# EAGLE design Wave Fold Osc MAIN V2.1 (EAGLE 7.7.0)
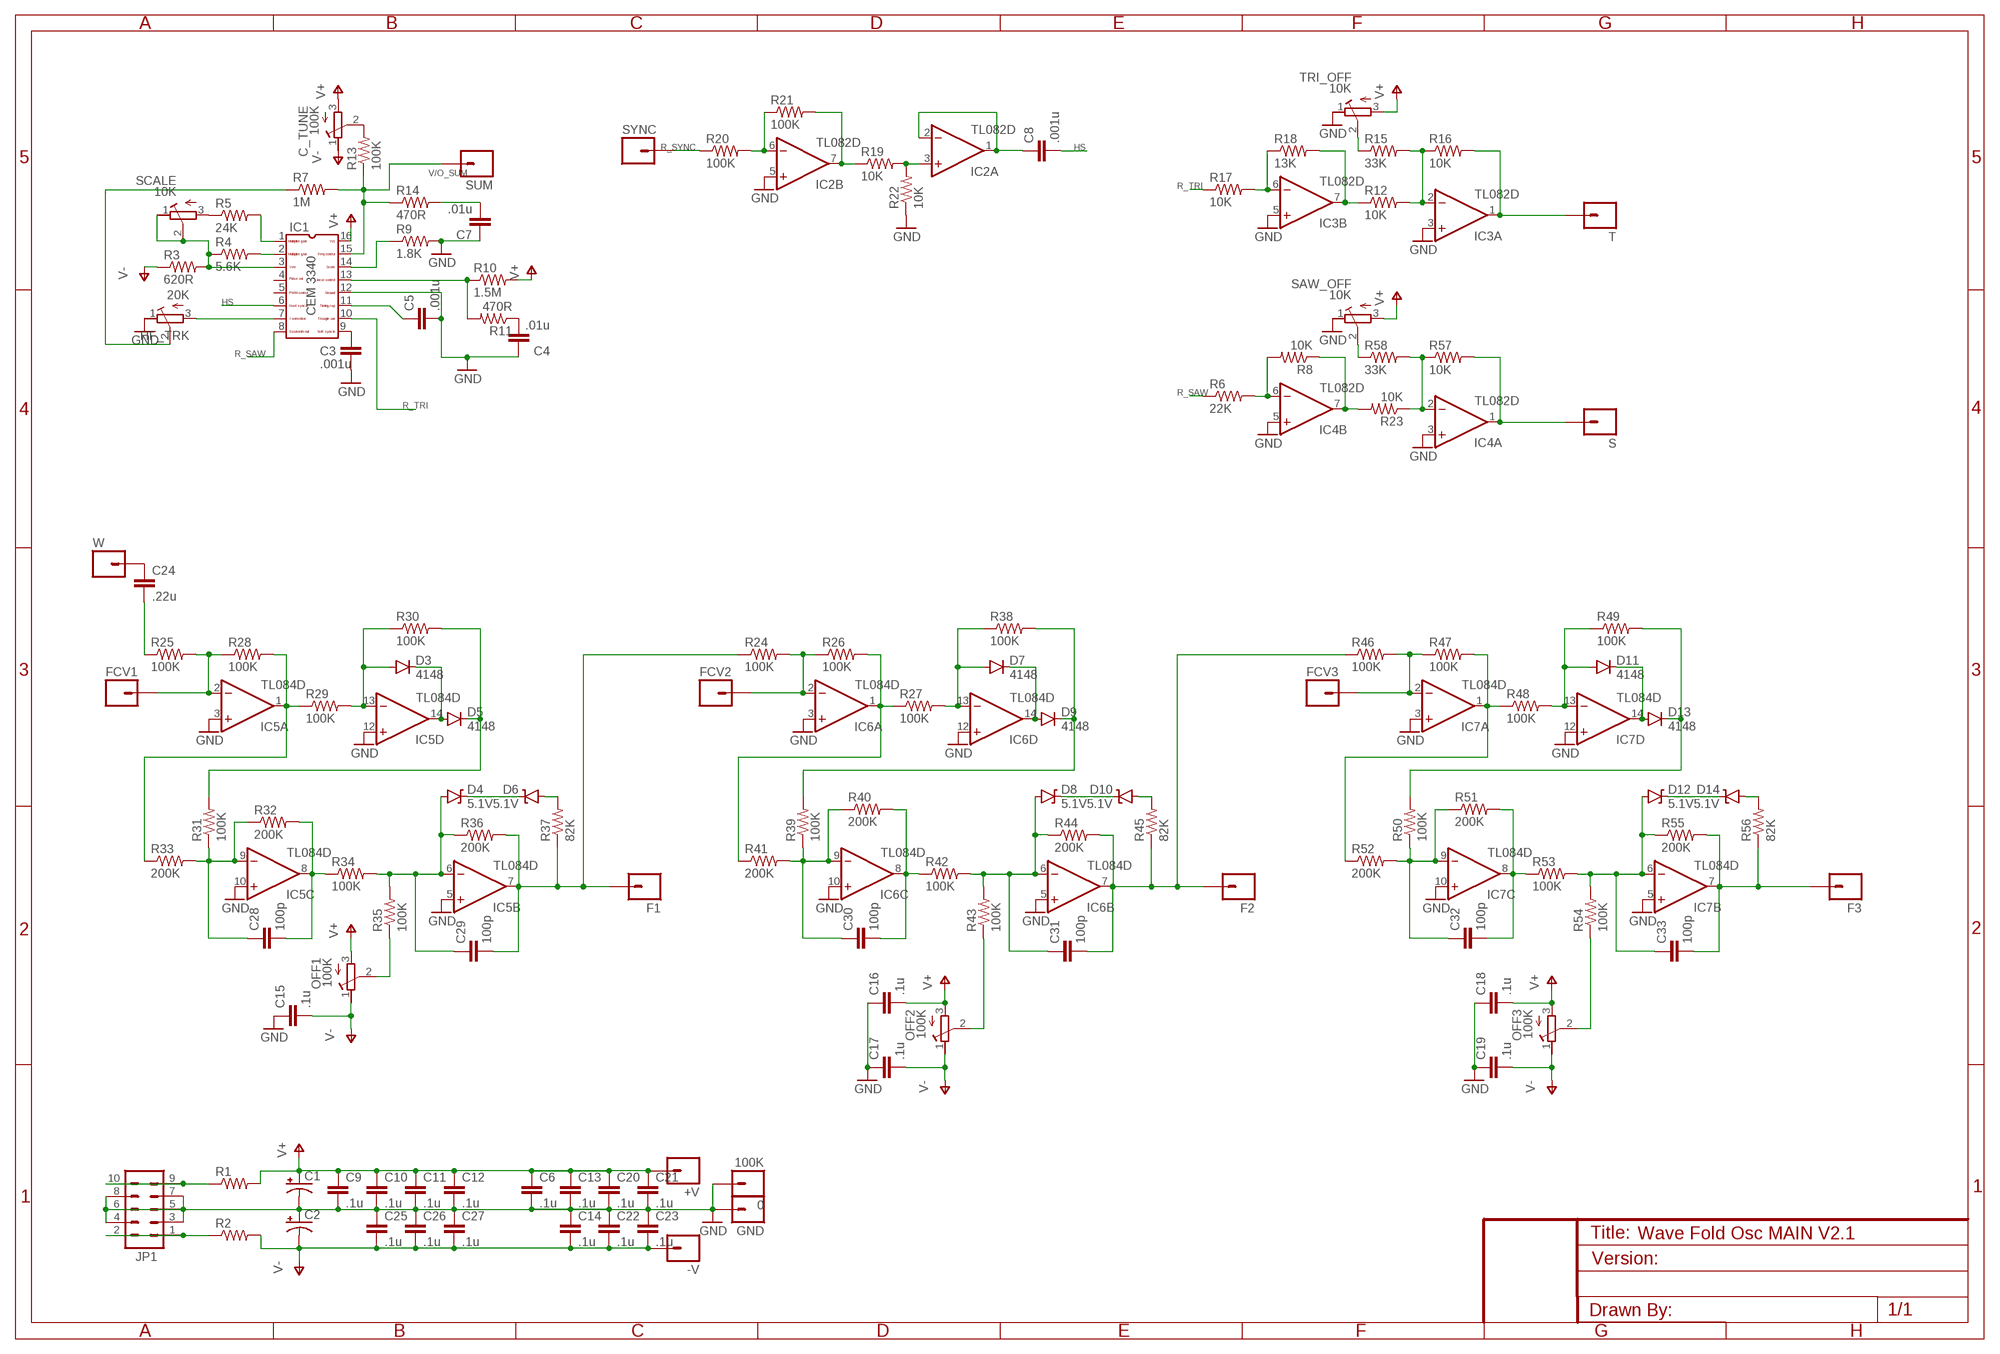
[diagram p0: schematic, sheet 1]

## Parts
0  100K  M01PTH  [1X01]
+V  M01PTH  [1X01]
-V  M01PTH  [1X01]
C1  CAP_POLC  [PANASONIC_C]
C2  CAP_POLC  [PANASONIC_C]
C3  .001u  CAP0805  [0805]
C4  .01u  CAP0805  [0805]
C5  .001u  C5/2.5  [C5B2.5]
C6  .1u  CAP0805  [0805@1]
C7  .01u  CAP0805  [0805]
C8  .001u  CAP0805  [0805]
C9  .1u  CAP0805  [0805@1]
C10  .1u  CAP0805  [0805@1]
C11  .1u  CAP0805  [0805@1]
C12  .1u  CAP0805  [0805@1]
C13  .1u  CAP0805  [0805@1]
C14  .1u  CAP0805  [0805@1]
C15  .1u  CAP0805  [0805]
C16  .1u  CAP0805  [0805]
C17  .1u  CAP0805  [0805]
C18  .1u  CAP0805  [0805]
C19  .1u  CAP0805  [0805]
C20  .1u  CAP0805  [0805@1]
C21  .1u  CAP0805  [0805@1]
C22  .1u  CAP0805  [0805@1]
C23  .1u  CAP0805  [0805@1]
C24  .22u  CAP0805  [0805@1]
C25  .1u  CAP0805  [0805@1]
C26  .1u  CAP0805  [0805@1]
C27  .1u  CAP0805  [0805@1]
C28  100p  CAP0805  [0805@1]
C29  100p  CAP0805  [0805@1]
C30  100p  CAP0805  [0805@1]
C31  100p  CAP0805  [0805@1]
C32  100p  CAP0805  [0805@1]
C33  100p  CAP0805  [0805@1]
C_TUNE  100K  R-TRIMM3314G  [RTRIM3314G]
D3  4148  DIODESOD123  [SOD-123]
D4  5.1V  DIODE-ZENER16V  [SOD-123]
D5  4148  DIODESOD123  [SOD-123]
D6  5.1V  DIODE-ZENER16V  [SOD-123]
D7  4148  DIODESOD123  [SOD-123]
D8  5.1V  DIODE-ZENER16V  [SOD-123]
D9  4148  DIODESOD123  [SOD-123]
D10  5.1V  DIODE-ZENER16V  [SOD-123]
D11  4148  DIODESOD123  [SOD-123]
D12  5.1V  DIODE-ZENER16V  [SOD-123]
D13  4148  DIODESOD123  [SOD-123]
D14  5.1V  DIODE-ZENER16V  [SOD-123]
F1  M01PTH  [1X01]
F2  M01PTH  [1X01]
F3  M01PTH  [1X01]
FCV1  M01PTH  [1X01]
FCV2  M01PTH  [1X01]
FCV3  M01PTH  [1X01]
GND  M01PTH  [1X01]
HF_TRK  20K  R-TRIMM3314G  [RTRIM3314G]
IC1  CEM3340_SMD  [SO16]
IC2  TL082D  [SO08]
IC3  TL082D  [SO08]
IC4  TL082D  [SO08]
IC5  TL084D  [SO14]
IC6  TL084D  [SO14]
IC7  TL084D  [SO14]
JP1  M05X2PTH  [AVR_ICSP]
OFF1  100K  R-TRIMM3314G  [RTRIM3314G]
OFF2  100K  R-TRIMM3314G  [RTRIM3314G]
OFF3  100K  R-TRIMM3314G  [RTRIM3314G]
R1  RESISTOR0805-RES  [0805]
R2  RESISTOR0805-RES  [0805]
R3  620R  RESISTOR0805-RES  [0805]
R4  5.6K  RESISTOR0805-RES  [0805]
R5  24K  RESISTOR0805-RES  [0805]
R6  22K  RESISTOR0805-RES  [0805]
R7  1M  RESISTOR0805-RES  [0805]
R8  10K  RESISTOR0805-RES  [0805]
R9  1.8K  RESISTOR0805-RES  [0805]
R10  1.5M  RESISTOR0805-RES  [0805]
R11  470R  RESISTOR0805-RES  [0805]
R12  10K  RESISTOR0805-RES  [0805]
R13  100K  RESISTOR0805-RES  [0805]
R14  470R  RESISTOR0805-RES  [0805]
R15  33K  RESISTOR0805-RES  [0805]
R16  10K  RESISTOR0805-RES  [0805]
R17  10K  RESISTOR0805-RES  [0805]
R18  13K  RESISTOR0805-RES  [0805]
R19  10K  RESISTOR0805-RES  [0805]
R20  100K  RESISTOR0805-RES  [0805]
R21  100K  RESISTOR0805-RES  [0805]
R22  10K  RESISTOR0805-RES  [0805]
R23  10K  RESISTOR0805-RES  [0805]
R24  100K  RESISTOR0805-RES  [0805]
R25  100K  RESISTOR0805-RES  [0805]
R26  100K  RESISTOR0805-RES  [0805]
R27  100K  RESISTOR0805-RES  [0805]
R28  100K  RESISTOR0805-RES  [0805]
R29  100K  RESISTOR0805-RES  [0805]
R30  100K  RESISTOR0805-RES  [0805]
R31  100K  RESISTOR0805-RES  [0805]
R32  200K  RESISTOR0805-RES  [0805]
R33  200K  RESISTOR0805-RES  [0805]
R34  100K  RESISTOR0805-RES  [0805]
R35  100K  RESISTOR0805-RES  [0805]
R36  200K  RESISTOR0805-RES  [0805]
R37  82K  RESISTOR0805-RES  [0805]
R38  100K  RESISTOR0805-RES  [0805]
R39  100K  RESISTOR0805-RES  [0805]
R40  200K  RESISTOR0805-RES  [0805]
R41  200K  RESISTOR0805-RES  [0805]
R42  100K  RESISTOR0805-RES  [0805]
R43  100K  RESISTOR0805-RES  [0805]
R44  200K  RESISTOR0805-RES  [0805]
R45  82K  RESISTOR0805-RES  [0805]
R46  100K  RESISTOR0805-RES  [0805]
R47  100K  RESISTOR0805-RES  [0805]
R48  100K  RESISTOR0805-RES  [0805]
R49  100K  RESISTOR0805-RES  [0805]
R50  100K  RESISTOR0805-RES  [0805]
R51  200K  RESISTOR0805-RES  [0805]
R52  200K  RESISTOR0805-RES  [0805]
R53  100K  RESISTOR0805-RES  [0805]
R54  100K  RESISTOR0805-RES  [0805]
R55  200K  RESISTOR0805-RES  [0805]
R56  82K  RESISTOR0805-RES  [0805]
R57  10K  RESISTOR0805-RES  [0805]
R58  33K  RESISTOR0805-RES  [0805]
S  M01PTH  [1X01]
SAW_OFF  10K  R-TRIMM3314G  [RTRIM3314G]
SCALE  10K  R-TRIMM3314G  [RTRIM3314G]
SUM  M01PTH  [1X01]
SYNC  M01PTH  [1X01]
T  M01PTH  [1X01]
TRI_OFF  10K  R-TRIMM3314G  [RTRIM3314G]
W  M01PTH  [1X01]

## Nets
GND: 0.1 C1.- C2.+ C3.2 C4.1 C5.2 C6.2 C7.1 C9.2 C10.2 C11.2 C12.2 C13.2 C14.1 C15.1 C16.1 C17.1 C18.1 C19.1 C20.2 C21.2 C22.1 C23.1 C25.1 C26.1 C27.1 GND.1 HF_TRK.1(E) IC1.12 IC2.5(B:+IN) IC3.3(A:+IN) IC3.5(B:+IN) IC4.3(A:+IN) IC4.5(B:+IN) IC5.3(A:+IN) IC5.5(B:+IN) IC5.10(C:+IN) IC5.12(D:+IN) IC6.3(A:+IN) IC6.5(B:+IN) IC6.10(C:+IN) IC6.12(D:+IN) IC7.3(A:+IN) IC7.5(B:+IN) IC7.10(C:+IN) IC7.12(D:+IN) JP1.3 JP1.4 JP1.5 JP1.6 JP1.7 JP1.8 R9.2 R22.1 SAW_OFF.1(E) TRI_OFF.1(E)
HS: C8.2 IC1.6
LFO_SW: C5.1 IC1.11
N$1: IC1.3 R3.2 R4.1 SCALE.1(E) SCALE.2(S)
N$2: JP1.9 JP1.10 R1.1
N$3: JP1.1 JP1.2 R2.1
N$4: IC1.2 R4.2
N$5: IC1.1 R5.2
N$6: R5.1 SCALE.3(A)
N$7: HF_TRK.3(A) IC1.7
N$8: HF_TRK.2(S) R7.1
N$9: C_TUNE.2(S) R13.2
N$10: IC1.14 R9.1
N$11: IC1.13 R10.1 R11.2
N$12: C3.1 IC1.9
N$13: IC3.6(B:-IN) R17.2 R18.1
N$14: C7.2 R14.2
N$15: IC4.6(B:-IN) R6.2 R8.2
N$16: IC4.7(B:OUT) R8.1 R23.2
N$17: C24.1 W.1
N$18: C4.2 R11.1
N$19: IC3.7(B:OUT) R12.1 R18.2
N$20: IC3.2(A:-IN) R12.2 R15.2 R16.1
N$21: IC3.1(A:OUT) R16.2 T.1
N$22: R15.1 TRI_OFF.2(S)
N$23: IC4.2(A:-IN) R23.1 R57.1 R58.2
N$24: IC2.3(A:+IN) R19.2 R22.2
N$25: IC2.6(B:-IN) R20.2 R21.1
N$26: IC2.7(B:OUT) R19.1 R21.2
N$27: C8.1 IC2.1(A:OUT) IC2.2(A:-IN)
N$28: IC4.1(A:OUT) R57.2 S.1
N$29: IC6.1(A:OUT) R26.2 R27.1 R41.1
N$30: FCV2.1 IC6.2(A:-IN) R24.2 R26.1
N$31: IC5.1(A:OUT) R28.2 R29.1 R33.1
N$32: D3.C D5.A IC5.14(D:OUT)
N$33: D3.A IC5.13(D:-IN) R29.2 R30.1
N$34: D5.C R30.2 R31.2
N$35: C28.1 IC5.9(C:-IN) R31.1 R32.1 R33.2
N$36: C28.2 IC5.8(C:OUT) R32.2 R34.1
N$37: C29.1 D4.A IC5.6(B:-IN) R34.2 R35.2 R36.1
N$38: OFF1.2(S) R35.1
N$39: D4.C D6.C
N$40: D6.A R37.2
N$41: C29.2 F1.1 IC5.7(B:OUT) R24.1 R36.2 R37.1
N$42: D7.C D9.A IC6.14(D:OUT)
N$43: D7.A IC6.13(D:-IN) R27.2 R38.1
N$44: D9.C R38.2 R39.2
N$45: C30.1 IC6.9(C:-IN) R39.1 R40.1 R41.2
N$46: C30.2 IC6.8(C:OUT) R40.2 R42.1
N$47: C31.1 D8.A IC6.6(B:-IN) R42.2 R43.2 R44.1
N$48: OFF2.2(S) R43.1
N$49: D8.C D10.C
N$50: D10.A R45.2
N$51: C31.2 F2.1 IC6.7(B:OUT) R44.2 R45.1 R46.1
N$52: IC7.1(A:OUT) R47.2 R48.1 R52.1
N$53: D11.C D13.A IC7.14(D:OUT)
N$54: D11.A IC7.13(D:-IN) R48.2 R49.1
N$55: D13.C R49.2 R50.2
N$56: C32.1 IC7.9(C:-IN) R50.1 R51.1 R52.2
N$57: C32.2 IC7.8(C:OUT) R51.2 R53.1
N$58: C33.1 D12.A IC7.6(B:-IN) R53.2 R54.2 R55.1
N$59: OFF3.2(S) R54.1
N$60: D12.C D14.C
N$61: D14.A R56.2
N$62: C33.2 F3.1 IC7.7(B:OUT) R55.2 R56.1
N$63: C24.2 R25.1
N$64: FCV3.1 IC7.2(A:-IN) R46.2 R47.1
N$65: FCV1.1 IC5.2(A:-IN) R25.2 R28.1
N$66: R58.1 SAW_OFF.2(S)
R_SAW: IC1.8 R6.1
R_SYNC: R20.1 SYNC.1
R_TRI: IC1.10 R17.1
V+: +V.1 C1.+ C6.1 C9.1 C10.1 C11.1 C12.1 C13.1 C16.2 C18.2 C20.1 C21.1 C_TUNE.3(A) IC1.16 OFF1.3(A) OFF2.3(A) OFF3.3(A) R1.2 R10.2 SAW_OFF.3(A) TRI_OFF.3(A)
V-: -V.1 C2.- C14.2 C15.2 C17.2 C19.2 C22.2 C23.2 C25.2 C26.2 C27.2 C_TUNE.1(E) OFF1.1(E) OFF2.1(E) OFF3.1(E) R2.2 R3.1
V/O_SUM: IC1.15 R7.2 R13.1 R14.1 SUM.1
Unconnected: IC1.4 IC1.5

## Power pins joined to a net without a drawn wire
V+: IC2.8(P:V+) IC3.8(P:V+) IC4.8(P:V+) IC5.4(P:V+) IC6.4(P:V+) IC7.4(P:V+)
V-: IC2.4(P:V-) IC3.4(P:V-) IC4.4(P:V-) IC5.11(P:V-) IC6.11(P:V-) IC7.11(P:V-)

## Library data of the parts
0 +V -V F1-F3 FCV1-FCV3 GND S SUM SYNC T W = SparkFun-Connectors:M01: Header 1 Standard 1-pin 0.1" header. Use with straight break away headers (SKU : PRT-00116), right angle break away headers (PRT-00553), swiss pins (PRT-00743), machine pins (PRT-00117), and female headers (PRT-00115).
C1 C2 = SparkFun-Passives:CAP_POL: Capacitor Polarized These are standard SMD and PTH capacitors. Normally 10uF, 47uF, and 100uF in electrolytic and tantalum varieties. Always verify the external diameter of the through hole cap, it varies with capacity, voltage, and manufacturer. The EIA devices should be standard.
C3 C4 C7 C8 C15-C19 = SparkFun-Capacitors:CAP: Capacitor Standard 0603 ceramic capacitor, and 0.1" leaded capacitor.
C5 = capacitor-wima:C: CAPACITOR naming: grid - package width
C6 C9-C14 C20-C33 = SparkFun-Passives:CAP: Capacitor Standard 0603 ceramic capacitor, and 0.1" leaded capacitor.
C_TUNE HF_TRK OFF1-OFF3 SAW_OFF SCALE TRI_OFF = rcl:R-TRIMM: Trimm resistor
D3 D5 D7 D9 D11 D13 = SparkFun-DiscreteSemi:DIODE: Diode These are standard reverse protection diodes and small signal diodes. SMA package can handle up to about 1A. SOD-323 can handle about 200mA. What the SOD-323 package when ordering, there are some mfgs out there that are 5-pin packages.
D4 D6 D8 D10 D12 D14 = SparkFun-DiscreteSemi:DIODE-ZENER: Zener Diode Production Part - 8199 3.4V Zener Voltage; PROD_ID: DIO-12440; VALUE: 16V
IC1 = CEM:CEM3340_SMD
IC2-IC4 = linear:TL082: OP AMP Data sheet <http://www.ti.com/lit/ds/symlink/tl084a . pdf>; DATA_SHEET: <a href="http://www.ti.com/lit/ds/symlink/tl084a.pdf"> Data sheet </a>
IC5-IC7 = linear:TL084: OP AMP
JP1 = SparkFun-Connectors:M05X2: Header 5x2 Standard 10-pin dual row 0.1" header. Commonly used with AVR-ISP. Use with Spark Fun Electronics SKU: PRT-00778
R1-R58 = SparkFun-Passives:RESISTOR: Resistor Basic schematic elements and footprints for 0603, 1206, and PTH resistors.

## Board
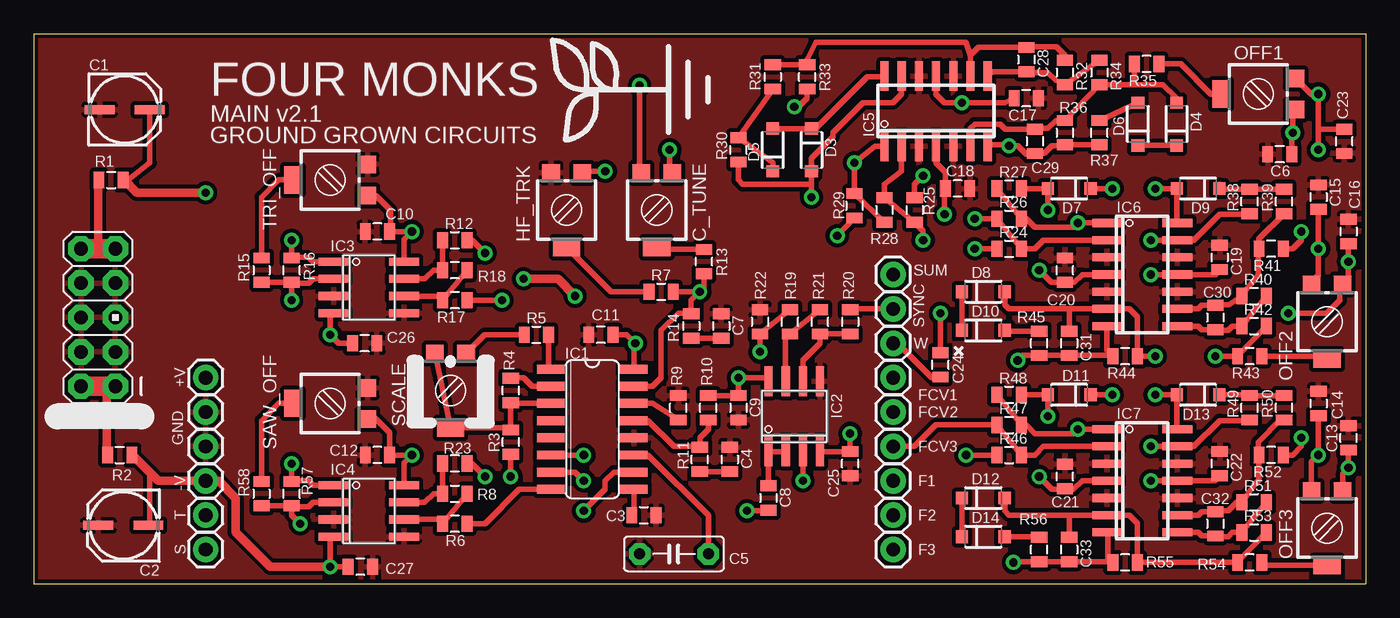
[diagram p1: board, top side]
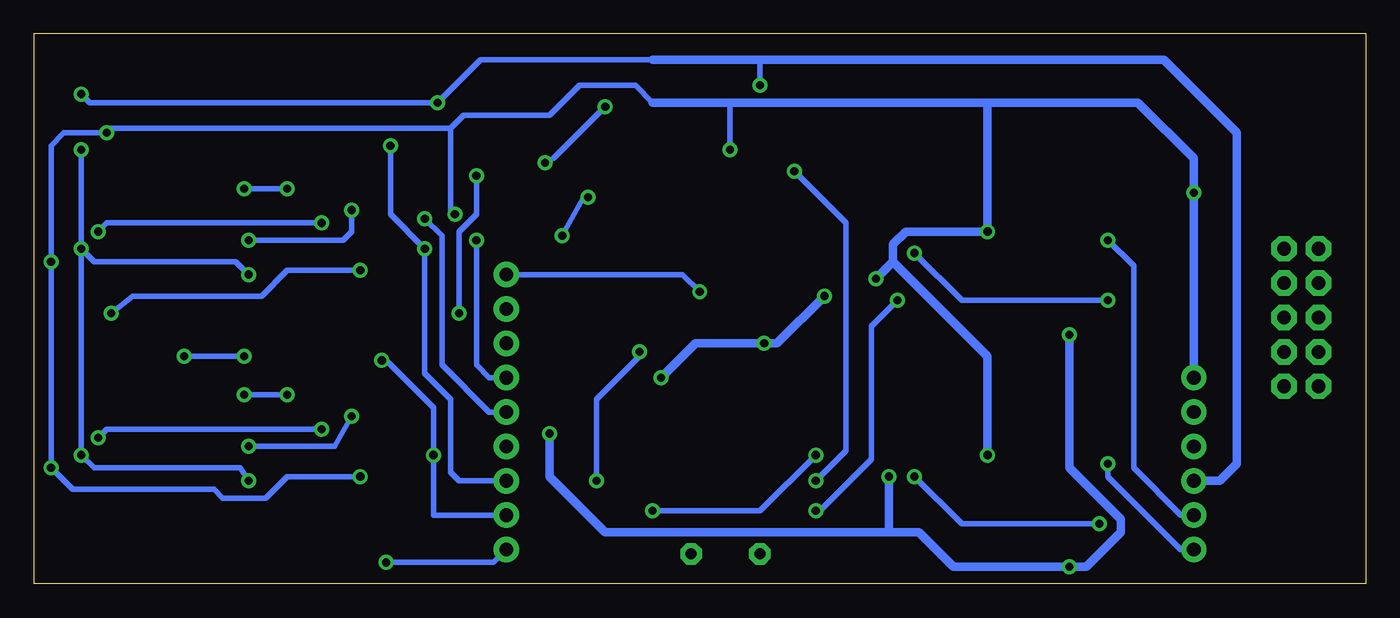
[diagram p2: board, bottom side, seen from below]

Size 98.42 x 40.64 mm. Coordinates in mm from the lower left corner, seen from the top.
Outline: 0,0 98.42,0 98.42,40.64 0,40.64 0,0
Copper layers (1*16): Top 0.035mm / dielectric 1.5mm / Bottom 0.035mm
Design rules "SparkFun": minimum track width 8mil, minimum drill 20mil, track to track 8mil, track to pad 8mil, pad to pad 8mil, via to via 8mil, smd to smd 8mil, copper to edge 8mil, drill to drill 8mil, minimum pad ring 12mil, minimum via ring 10mil, stop-mask expansion 4mil, vias tented up to drill 20mil, thermal gap 10mil

### Footprints (pad centres in the part's own frame; a part is rotated, then mirrored left to right if it is on the bottom)
1X01 = drill 1.016 pad 1.88: 1 0,0
PANASONIC_C = smd 2.2 x 0.65: + 1.9,-0.2; - -1.8,-0.2
0805 = smd 0.8 x 1.2: 1 -0.9,0; 2 0.9,0
C5B2.5 = drill 0.813 pad 1.6 octagon: 1 -2.54,0; 2 2.54,0
0805@1 = smd 0.8 x 1.2: 1 -0.9,0; 2 0.9,0
RTRIM3314G = smd 1.3 x 1.3: 1 1.15,-2.75; 3 -1.15,-2.75 | smd 2 x 1.3: 2 0,2.75
SOD-123 = smd 0.9 x 0.95: A 1.575,0; C -1.575,0
SO16 = smd 0.66 x 2.032: 1 -4.445,-3.073; 2 -3.175,-3.073; 3 -1.905,-3.073; 4 -0.635,-3.073; 5 0.635,-3.073; 6 1.905,-3.073; 7 3.175,-3.073; 8 4.445,-3.073; 9 4.445,3.073; 10 3.175,3.073; 11 1.905,3.073; 12 0.635,3.073; 13 -0.635,3.073; 14 -1.905,3.073; 15 -3.175,3.073; 16 -4.445,3.073
SO08 = smd 0.6 x 2.2: 1 -1.905,-2.6; 2 -0.635,-2.6; 3 0.635,-2.6; 4 1.905,-2.6; 5 1.905,2.6; 6 0.635,2.6; 7 -0.635,2.6; 8 -1.905,2.6
SO14 = smd 0.6 x 2.2: 1 -3.81,-2.6; 2 -2.54,-2.6; 3 -1.27,-2.6; 4 0,-2.6; 5 1.27,-2.6; 6 2.54,-2.6; 7 3.81,-2.6; 8 3.81,2.6; 9 2.54,2.6; 10 1.27,2.6; 11 0,2.6; 12 -1.27,2.6; 13 -2.54,2.6; 14 -3.81,2.6
AVR_ICSP = drill 1.016 pad 1.88 octagon: 1 -1.27,5.08; 2 1.27,5.08; 3 -1.27,2.54; 4 1.27,2.54; 5 -1.27,0; 6 1.27,0; 7 -1.27,-2.54; 8 1.27,-2.54; 9 -1.27,-5.08; 10 1.27,-5.08

### Placement (x,y rotation side)
0  12.7,12.7 0 top
+V  12.7,15.24 0 top
-V  12.7,7.62 0 top
C1  6.67,35.24 0 top
C2  6.67,4.13 180 top
C3  45.09,5.08 0 top
C4  51.44,9.21 270 top
C5  47.31,2.22 180 top
C6  92.08,31.75 180 top
C7  50.8,19.05 270 top
C8  54.29,6.35 270 top
C9  52.07,13.02 270 top
C10  25.4,26.04 180 top
C11  41.91,18.41 180 top
C12  25.4,9.53 180 top
C13  97.16,10.79 90 top
C14  94.93,13.34 270 top
C15  94.93,28.57 270 top
C16  97.16,26.04 270 top
C17  73.34,35.88 180 top
C18  68.26,29.21 180 top
C19  87.63,24.13 270 top
C20  76.2,23.18 90 top
C21  76.2,7.94 90 top
C22  87.63,8.89 270 top
C23  96.84,32.7 90 top
C24  66.99,16.19 90 top
C25  60.33,8.89 90 top
C26  24.45,17.78 180 top
C27  24.13,1.27 180 top
C28  73.34,38.73 270 top
C29  73.98,32.7 270 top
C30  87.31,19.68 270 top
C31  76.52,17.78 270 top
C32  87.31,4.45 270 top
C33  76.52,2.54 270 top
C_TUNE  46.04,27.62 180 top
D3  57.47,32.07 270 top
D4  84.45,33.97 90 top
D5  54.61,32.07 90 top
D6  81.6,33.97 90 top
D7  76.52,29.21 180 top
D8  70.17,21.59 0 top
D9  86.04,29.21 180 top
D10  70.17,18.73 0 top
D11  76.52,13.97 180 top
D12  70.17,6.35 0 top
D13  86.04,13.97 180 top
D14  70.17,3.49 0 top
F1  63.5,7.62 0 top
F2  63.5,5.08 0 top
F3  63.5,2.54 0 top
FCV1  63.5,15.24 0 top
FCV2  63.5,12.7 0 top
FCV3  63.5,10.16 0 top
GND  12.7,10.16 0 top
HF_TRK  39.37,27.62 180 top
IC1  41.27,11.43 270 top
IC2  56.2,12.38 0 top
IC3  24.77,21.91 270 top
IC4  24.77,5.4 270 top
IC5  66.67,34.92 0 top
IC6  81.92,22.86 270 top
IC7  81.92,7.62 270 top
JP1  4.76,19.68 180 top
OFF1  90.49,36.2 90 top
OFF2  95.57,19.37 180 top
OFF3  95.57,4.13 180 top
R1  5.71,29.84 0 top
R2  6.35,9.53 0 top
R3  35.24,10.48 90 top
R4  35.24,14.29 90 top
R5  37.15,18.41 0 top
R6  31.11,4.45 180 top
R7  46.35,21.59 0 top
R8  31.11,6.67 0 top
R9  47.62,13.02 90 top
R10  49.85,13.02 90 top
R11  49.21,9.21 90 top
R12  31.11,25.4 0 top
R13  49.53,23.81 90 top
R14  48.58,19.05 270 top
R15  16.83,23.18 270 top
R16  19.05,23.18 90 top
R17  31.11,20.95 180 top
R18  31.11,23.18 180 top
R19  55.88,19.37 90 top
R20  60.33,19.37 270 top
R21  58.1,19.37 90 top
R22  53.66,19.37 270 top
R23  31.11,8.89 180 top
R24  72.07,24.77 0 top
R25  65.09,27.62 270 top
R26  72.07,26.99 0 top
R27  72.07,29.21 0 top
R28  62.87,27.62 270 top
R29  60.64,27.94 270 top
R30  52.07,32.07 90 top
R31  54.61,37.47 270 top
R32  76.2,37.78 270 top
R33  57.15,37.47 90 top
R34  78.74,37.78 270 top
R35  82.23,38.42 180 top
R36  76.2,33.34 270 top
R37  78.74,33.34 90 top
R38  89.85,28.26 90 top
R39  92.39,28.26 90 top
R40  90.17,21.27 0 top
R41  91.44,24.77 180 top
R42  90.17,19.05 0 top
R43  89.85,16.83 180 top
R44  80.64,16.83 180 top
R45  74.3,17.78 90 top
R46  72.07,9.53 0 top
R47  72.07,11.75 0 top
R48  72.07,13.97 0 top
R49  89.85,13.02 90 top
R50  92.39,13.02 90 top
R51  90.17,6.03 0 top
R52  91.44,9.53 180 top
R53  90.17,3.81 0 top
R54  89.85,1.59 180 top
R55  80.64,1.59 180 top
R56  74.3,2.54 90 top
R57  19.05,6.67 90 top
R58  16.83,6.67 270 top
S  12.7,2.54 270 top
SAW_OFF  21.91,13.34 90 top
SCALE  30.8,14.29 180 top
SUM  63.5,22.86 0 top
SYNC  63.5,20.32 0 top
T  12.7,5.08 270 top
TRI_OFF  21.91,29.84 90 top
U$1  [LOGO_MED]  46.83,36.51 90 top
W  63.5,17.78 0 top

### Tracks (layer width: path | path; a pad name or v marks a point on that pad's centre or on a via)
GND
  pour Top (isolate 0.305): 0,0 0,40.64 98.42,40.64 98.42,0
HS  (via drill 0.6)
  Top 0.406: IC1.6 v40.64,9.53 | v52.7,5.4 54.24,5.4 C8.2
  Bottom 0.406: v40.64,9.53 44.77,5.4 v52.7,5.4
LFO_SW
  Top 0.406: IC1.11 45.4,9.53 49.85,5.08 C5.1
N$1
  Top 0.406: IC1.3 35.3,13.34 R4.1 R3.2 35.08,11.54 SCALE.2 SCALE.1
N$2
  Top 0.61: R1.1 4.76,29.84 4.76,24.77
  Top 1.422: JP1.10 4.76,24.77 JP1.9
N$3
  Top 0.61: R2.1 5.4,9.53 5.4,14.61
  Top 1.422: JP1.2 5.4,14.61 JP1.1
N$4
  Top 0.406: IC1.2 36.83,14.61 36.2,15.24 35.3,15.24 R4.2
N$5
  Top 0.406: R5.2 38.05,16.03 IC1.1
N$6
  Top 0.406: R5.1 33.33,18.41 SCALE.3
N$7  (via drill 0.6)
  Top 0.406: IC1.7 40.01,8.26 v40.64,7.62 | v42.23,30.48 40.63,30.48 HF_TRK.3
  Bottom 0.406: v40.64,7.62 38.42,9.84 38.42,26.67 v42.23,30.48
N$8
  Top 0.406: R7.1 42.65,21.59 HF_TRK.2
N$9
  Top 0.406: R13.2 46.2,24.71 C_TUNE.2
N$10
  Top 0.406: IC1.14 45.72,13.34 R9.1
N$11
  Top 0.406: IC1.13 45.4,12.06 47.31,10.16 49.16,10.16 R11.2 49.21,10.79 49.85,11.43 R10.1
N$12
  Top 0.406: IC1.9 44.35,5.24 C3.1
N$13
  Top 0.406: IC3.6 29.9,21.27 R17.2 R18.1
N$14
  Top 0.406: R14.2 C7.2
N$15
  Top 0.406: IC4.6 29.9,4.76 R6.2 R8.2
N$16
  Top 0.406: IC4.7 28.89,6.03 29.53,6.67 R8.1 R23.2
N$17
  Top 0.406: W.1 63.82,17.78 66.36,15.24 66.94,15.24 C24.1
N$18
  Top 0.406: R11.1 C4.2
N$19
  Top 0.406: IC3.7 28.89,22.54 29.53,23.18 R18.2 R12.1
N$20  (via drill 0.6)
  Top 0.406: IC3.2 20.64,22.54 20.32,22.23 19.1,22.23 R16.1 | R16.1 R15.2 | R12.2 32.38,25.4 v33.34,24.45 | v19.05,20.95 R16.1
  Bottom 0.406: v33.34,24.45 29.84,20.95 v19.05,20.95
N$21  (via drill 0.6)
  Top 0.406: IC3.1 20.64,23.81 20.32,24.13 19.1,24.13 R16.2 v19.05,25.4
  Bottom 0.406: T.1 13.65,5.08 17.14,8.57 17.14,23.5 v19.05,25.4
N$22
  Top 0.406: TRI_OFF.2 18.1,29.84 16.83,28.57 R15.1
N$23  (via drill 0.6)
  Top 0.406: R23.1 32.38,8.89 v33.34,7.94 | IC4.2 20.64,6.03 20.32,5.71 19.1,5.71 R57.1 | R57.1 R58.2 | R57.1 19.05,5.08 v19.68,4.45
  Bottom 0.406: v33.34,7.94 29.84,4.45 v19.68,4.45
N$24  (via drill 0.6)
  Top 0.406: v53.66,17.14 R22.2 R19.2 | v56.83,7.62 IC2.3
  Bottom 0.406: v53.66,17.14 53.66,16.83 56.83,13.65 v56.83,7.62
N$25
  Top 0.406: R20.2 R21.1 58.1,17.78 56.83,16.51 IC2.6
N$26
  Top 0.406: R21.2 R19.1 55.56,18.15 IC2.7
N$27
  Top 0.406: IC2.2 IC2.1 C8.1
N$28  (via drill 0.6)
  Top 0.406: IC4.1 20.64,7.3 20.32,7.62 19.1,7.62 R57.2 v19.05,8.89
  Bottom 0.406: v19.05,8.89 19.05,7.94 13.65,2.54 S.1
N$29  (via drill 0.6)
  Top 0.406: R27.1 R26.2 73.34,26.99 73.98,26.35 76.83,26.35 v77.15,26.67 IC6.1 | v93.66,26.04 93.66,25.4 93.03,24.77 R41.1
  Bottom 0.406: v77.15,26.67 93.03,26.67 v93.66,26.04
N$30  (via drill 0.6)
  Top 0.406: IC6.2 74.61,25.4 73.98,24.77 R24.2 R26.1 v69.53,26.99
  Bottom 0.406: FCV2.1 64.77,12.7 68.26,16.19 68.26,25.72 v69.53,26.99
N$31  (via drill 0.6)
  Top 0.406: R28.2 R29.1 v60.64,31.11 62.17,32.33 IC5.1 | v56.2,35.24 56.52,35.24 57.15,35.88 R33.1
  Bottom 0.406: v60.64,31.11 60.01,31.43 v56.2,35.24
N$32
  Top 0.406: D5.A D3.C 57.77,33.64 61.59,37.47 62.8,37.47 IC5.14
N$33  (via drill 0.6)
  Top 0.406: R30.1 52.07,29.84 52.39,29.53 57.47,29.53 | 57.47,29.53 v57.47,28.57 | v59.37,25.72 R29.2 | D3.A 57.47,29.53 | D3.A 57.8,30.49 | IC5.13 64.14,36.2 63.5,35.56 61.28,35.56 59.05,33.34 59.05,33.02 57.47,31.43 D3.A
  Bottom 0.406: v57.47,28.57 57.78,28.57 v59.37,25.72
N$34
  Top 0.406: D5.C 54.61,31.11 R30.2 R31.2
N$35
  Top 0.406: R32.1 76.2,39.05 75.56,39.69 73.39,39.69 C28.1 69.8,39.63 69.22,39.05 | 69.22,39.05 IC5.9 | R31.1 R33.2 57.15,38.73 57.78,40.01 68.9,40.01 69.22,39.05
N$36
  Top 0.406: R34.1 R32.2 75.51,37.2 74.93,37.78 73.39,37.78 C28.2 70.8,37.84 IC5.8 70.74,37.78
N$37
  Top 0.406: D4.A 84.45,35.88 83.45,36.88 81.28,36.88 | 81.28,36.88 R34.2 R36.1 75.51,34.24 74.93,33.66 74.03,33.66 C29.1 71.81,33.6 71.44,33.97 69.53,33.97 69.22,33.66 IC5.6 | R35.2 81.33,36.94 81.28,36.88
N$38
  Top 0.406: R35.1 84.77,38.42 87,36.2 OFF1.2
N$39
  Top 0.406: D6.C D4.C
N$40
  Top 0.406: R37.2 D6.A
N$41  (via drill 0.6)
  Top 0.406: R24.1 v69.53,24.77 | R37.1 R36.2 76.15,32.38 75.25,32.38 74.67,31.8 C29.2 73.92,31.75 73.34,31.75 72.71,32.38 v72.07,32.38 71.7,32.44 70.6,32.44 IC5.7
  Bottom 0.406: F1.1 66.99,7.62 67.63,8.26 67.63,13.65 69.53,15.56 v69.53,24.77 72.07,27.3 v72.07,32.38
N$42  (via drill 0.6)
  Top 0.406: IC6.14 84.47,26.67 D9.A v82.87,29.21 | D7.C v79.69,29.21
  Bottom 0.406: v79.69,29.21 v82.87,29.21
N$43  (via drill 0.6)
  Top 0.406: R27.2 D7.A 74.94,27.64 v74.93,27.62 | R38.1 89.8,27.3 87.63,27.3 85.72,25.4 IC6.13 v82.55,25.4
  Bottom 0.406: v74.93,27.62 74.93,26.04 75.56,25.4 v82.55,25.4
N$44
  Top 0.406: 87.63,29.53 87.62,29.52 D9.C 87.67,29.16 R38.2 R39.2
N$45
  Top 0.406: R39.1 90.54,25.5 R41.2 90.49,24.71 90.49,22.86 89.27,21.32 R40.1 88.32,20.64 87.36,20.64 C30.1 86.31,20.59 86.04,20.32 IC6.9
N$46
  Top 0.406: R40.2 R42.1 88.58,19.05 88.27,18.73 87.36,18.73 C30.2 86.31,18.79 86.04,19.05 IC6.8
N$47  (via drill 0.6)
  Top 0.406: R42.2 R43.2 v87.31,16.83 | 76.52,20.32 IC6.6 80.96,20.32 81.55,19.74 R44.1 v82.87,16.83 | 76.52,20.32 72.07,20.32 71.75,20.64 71.75,21.58 D8.A | C31.1 76.52,20.32
  Bottom 0.406: v82.87,16.83 v87.31,16.83
N$48
  Top 0.406: R43.1 95.57,16.83 OFF2.2
N$49
  Top 0.406: D10.C D8.C
N$50
  Top 0.406: R45.2 71.8,18.68 D10.A
N$51  (via drill 0.6)
  Top 0.406: IC6.7 79.31,17.26 79.69,16.88 | 79.69,16.88 R44.2 | v72.71,16.51 73.08,16.88 R45.1 C31.2 79.69,16.88 | R46.1 v68.9,9.53
  Bottom 0.406: F2.1 68.9,5.08 v68.9,9.53 68.9,13.02 72.39,16.51 v72.71,16.51
N$52  (via drill 0.6)
  Top 0.406: v93.66,10.79 93.66,10.16 93.03,9.53 R52.1 | IC7.1 v77.15,11.43 76.83,11.11 73.98,11.11 73.34,11.75 R47.2 R48.1
  Bottom 0.406: v77.15,11.43 93.03,11.43 v93.66,10.79
N$53  (via drill 0.6)
  Top 0.406: D11.C v79.69,13.97 | v82.87,13.97 D13.A 84.47,11.43 IC7.14
  Bottom 0.406: v79.69,13.97 v82.87,13.97
N$54  (via drill 0.6)
  Top 0.406: R48.2 D11.A 74.93,13.96 v74.93,12.38 | R49.1 89.8,12.06 87.63,12.06 85.72,10.16 IC7.13 v82.55,10.16
  Bottom 0.406: v82.55,10.16 76.2,10.16 v74.93,12.38
N$55
  Top 0.406: D13.C 89.8,13.97 R49.2 R50.2
N$56
  Top 0.406: R50.1 92.13,12.12 90.49,10.48 90.49,9.58 R52.2 90.54,7.67 90.17,7.3 90.17,7.25 R51.1 88.9,6.03 88.27,5.4 87.36,5.4 C32.1 86.31,5.34 86.04,5.08 IC7.9
N$57
  Top 0.406: R51.2 R53.1 88.58,3.81 88.27,3.49 87.36,3.49 C32.2 86.31,3.54 86.04,3.81 IC7.8
N$58
  Top 0.406: R53.2 R54.2 R55.1 81.55,4.5 80.96,5.08 IC7.6 76.52,5.08 | 76.52,5.08 72.07,5.08 71.75,5.4 71.75,6.34 D12.A | C33.1 76.52,5.08
N$59
  Top 0.406: OFF3.2 90.96,1.38 R54.1
N$60
  Top 0.406: D12.C D14.C
N$61
  Top 0.406: D14.A 74.24,3.49 R56.2
N$62  (via drill 0.6)
  Top 0.406: R55.2 79.69,1.59 79.38,1.91 | 79.38,1.91 79.38,3.75 IC7.7 | 79.38,1.91 79.38,1.64 C33.2 R56.1 72.39,1.64 v72.39,1.59
  Bottom 0.406: v72.39,1.59 64.45,1.59 F3.1
N$63  (via drill 0.6)
  Top 0.406: R25.1 65.09,29.53 v65.72,30.16 | C24.2 v66.99,20
  Bottom 0.406: v65.72,30.16 65.72,27.3 66.99,26.04 v66.99,20
N$64
  Top 0.406: IC7.2 74.61,10.16 73.98,9.53 R46.2 R47.1 66.67,11.75 65.09,10.16 FCV3.1
N$65  (via drill 0.6)
  Top 0.406: IC5.2 64.14,30.48 62.87,29.53 R28.1 R25.2 65.72,26.09 v65.72,25.4
  Bottom 0.406: v65.72,25.4 65.72,16.19 64.77,15.24 FCV1.1
N$66
  Top 0.406: SAW_OFF.2 18.1,13.34 16.83,12.06 R58.1
R_SAW
  Top 0.406: IC1.8 35.88,6.99 33.34,4.45 R6.1
R_SYNC
  Top 0.406: SYNC.1 60.33,20.32 R20.1
R_TRI  (via drill 0.6)
  Top 0.406: IC1.10 42.86,8.26 42.23,7.62 42.23,6.99 v40.64,5.4 | v34.61,20.95 R17.1
  Bottom 0.406: v40.64,5.4 40.32,5.4 36.51,9.21 36.51,19.05 v34.61,20.95
V+  (via drill 0.6)
  Top 0.406: R1.2 6.99,29.84 8.57,31.11 C1.+ | OFF1.3 93.03,34.84 v93.03,33.34 92.97,33.28 C6.1 | C16.2 v97.16,23.81 97.16,22.55 OFF2.3 96.52,21.92 96.52,20.95 95.57,20 v92.71,20 | C13.1 v97.16,8.57 96.72,8.13 OFF3.3 | IC5.4 66.67,31.11 67.36,30.43 C18.2 67.31,29.16 v67.31,27.3 | v74.3,23.18 75.19,22.28 C20.1 76.89,22.28 77.47,22.86 IC6.4 | v74.3,7.94 75.25,6.99 76.15,6.99 C21.1 76.25,6.99 76.83,6.99 77.47,7.62 IC7.4 | R10.2 C9.1 v52.07,15.24 54.03,15.24 IC2.8 | IC1.16 44.35,17.68 v44.45,17.78 43.81,18.41 C11.1 | C_TUNE.3 46.99,30.57 v46.99,32.07 | TRI_OFF.3 25.28,28.7 26.35,27.62 26.35,26.09 C10.1 v27.94,26.04 27.36,25.46 IC3.8 | IC4.8 27.36,8.95 v27.94,9.53 C12.1 26.3,11.16 25.08,12.38 24.86,12.38 SAW_OFF.3
  Top 0.61: 6.62,29.58 R1.2 6.67,29.84 7.62,28.89 v12.7,28.89 | v36.2,22.54 38.73,22.54 v40.01,21.27
  Bottom 0.406: 52.7,35.56 53.98,36.83 58.1,36.83 60.33,34.61 66.67,34.61 67.63,33.66 | 67.63,33.66 92.71,33.66 v93.03,33.34 96.2,33.34 97.16,32.38 v97.16,23.81 v97.16,8.57 95.57,6.99 85.09,6.99 84.45,6.35 81.28,6.35 79.69,7.94 v74.3,7.94 | v74.3,23.18 79.69,23.18 81.6,21.27 91.12,21.27 v92.71,20 | 67.63,33.66 67.63,27.62 v67.31,27.3 | v46.99,32.07 46.99,35.56
  Bottom 0.61: +V.1 v12.7,28.89 12.7,31.43 16.83,35.56 27.94,35.56 | 27.94,35.56 46.99,35.56 52.7,35.56 | v52.07,15.24 49.53,17.78 v44.45,17.78 43.5,17.78 v40.01,21.27 | 27.94,35.56 v27.94,26.04 33.97,26.04 34.92,25.08 34.92,23.81 | 34.92,23.81 27.94,16.83 v27.94,9.53 | 34.92,23.81 v36.2,22.54
V-  (via drill 0.6)
  Top 0.406: 8.57,8.26 8.57,4.43 C2.- | IC5.11 66.67,36.2 67.31,35.56 v68.58,35.56 71.75,35.56 72.39,35.88 C17.2 | OFF1.1 94.39,36.2 v94.93,36.2 94.93,33.66 | 94.93,33.66 v94.93,32.07 | C15.2 v94.93,24.77 94.93,22.86 94.42,22.34 OFF2.1 | C14.2 v94.93,9.53 94.42,9.01 OFF3.1 | C23.2 94.98,33.6 94.93,33.66 | C19.2 87.63,23.18 87.31,22.86 IC6.11 v82.55,22.86 | v82.55,7.62 IC7.11 87.26,7.62 C22.2 | C_TUNE.1 44.77,30.49 v44.77,36.83 | IC2.4 60.32,9.78 C25.2 v60.33,11.11 | v35.24,7.94 R3.1 | IC4.4 21.91,3.23 v21.91,1.27 C27.2 | C26.2 22.54,17.78 v21.91,18.41 21.91,19.75 IC3.4
  Top 0.61: R2.2 7.3,9.53 8.57,8.26 9.21,7.62 -V.1 13.65,7.62 14.92,6.35 14.92,3.81 17.46,1.27 v21.91,1.27
  Bottom 0.406: 52.7,38.73 65.41,38.73 v68.58,35.56 94.3,35.56 v94.93,36.2 | v94.93,32.07 v94.93,24.77 | v94.93,24.77 v94.93,9.53 93.98,8.57 83.19,8.57 v82.55,7.62 | v94.93,24.77 93.98,23.81 83.5,23.81 v82.55,22.86 | v44.77,36.83 44.77,38.73
  Bottom 0.61: -V.1 10.79,7.62 9.53,8.89 9.53,33.34 14.92,38.73 44.77,38.73 52.7,38.73 | v60.33,11.11 60.33,7.94 56.2,3.81 35.24,3.81 | 35.24,3.81 v35.24,7.94 | 35.24,3.81 33.02,3.81 30.48,1.27 v21.91,1.27 20.64,1.27 18.1,3.81 18.1,4.76 21.91,8.57 v21.91,18.41
V/O_SUM  (via drill 0.6)
  Top 0.406: R13.1 49.53,21.91 v49.21,21.59 | R7.2 v49.21,21.59 | IC1.15 45.72,14.61 46.35,15.24 46.35,18.73 47.62,20 48.52,20 R14.1 48.58,20.95 v49.21,21.59
  Bottom 0.406: SUM.1 50.48,22.86 v49.21,21.59

### Text on the board
tPlace: FOUR MONKS | MAIN v2.1 | GROUND GROWN CIRCUITS